# Altium schematic sheet 13- EtherCAT.SchDoc: ETHERCAT
size 420 x 297 mm; Revision: 1.0; SheetNumber: 13; SheetTotal: 13; Project: LOW LEVEL ECU
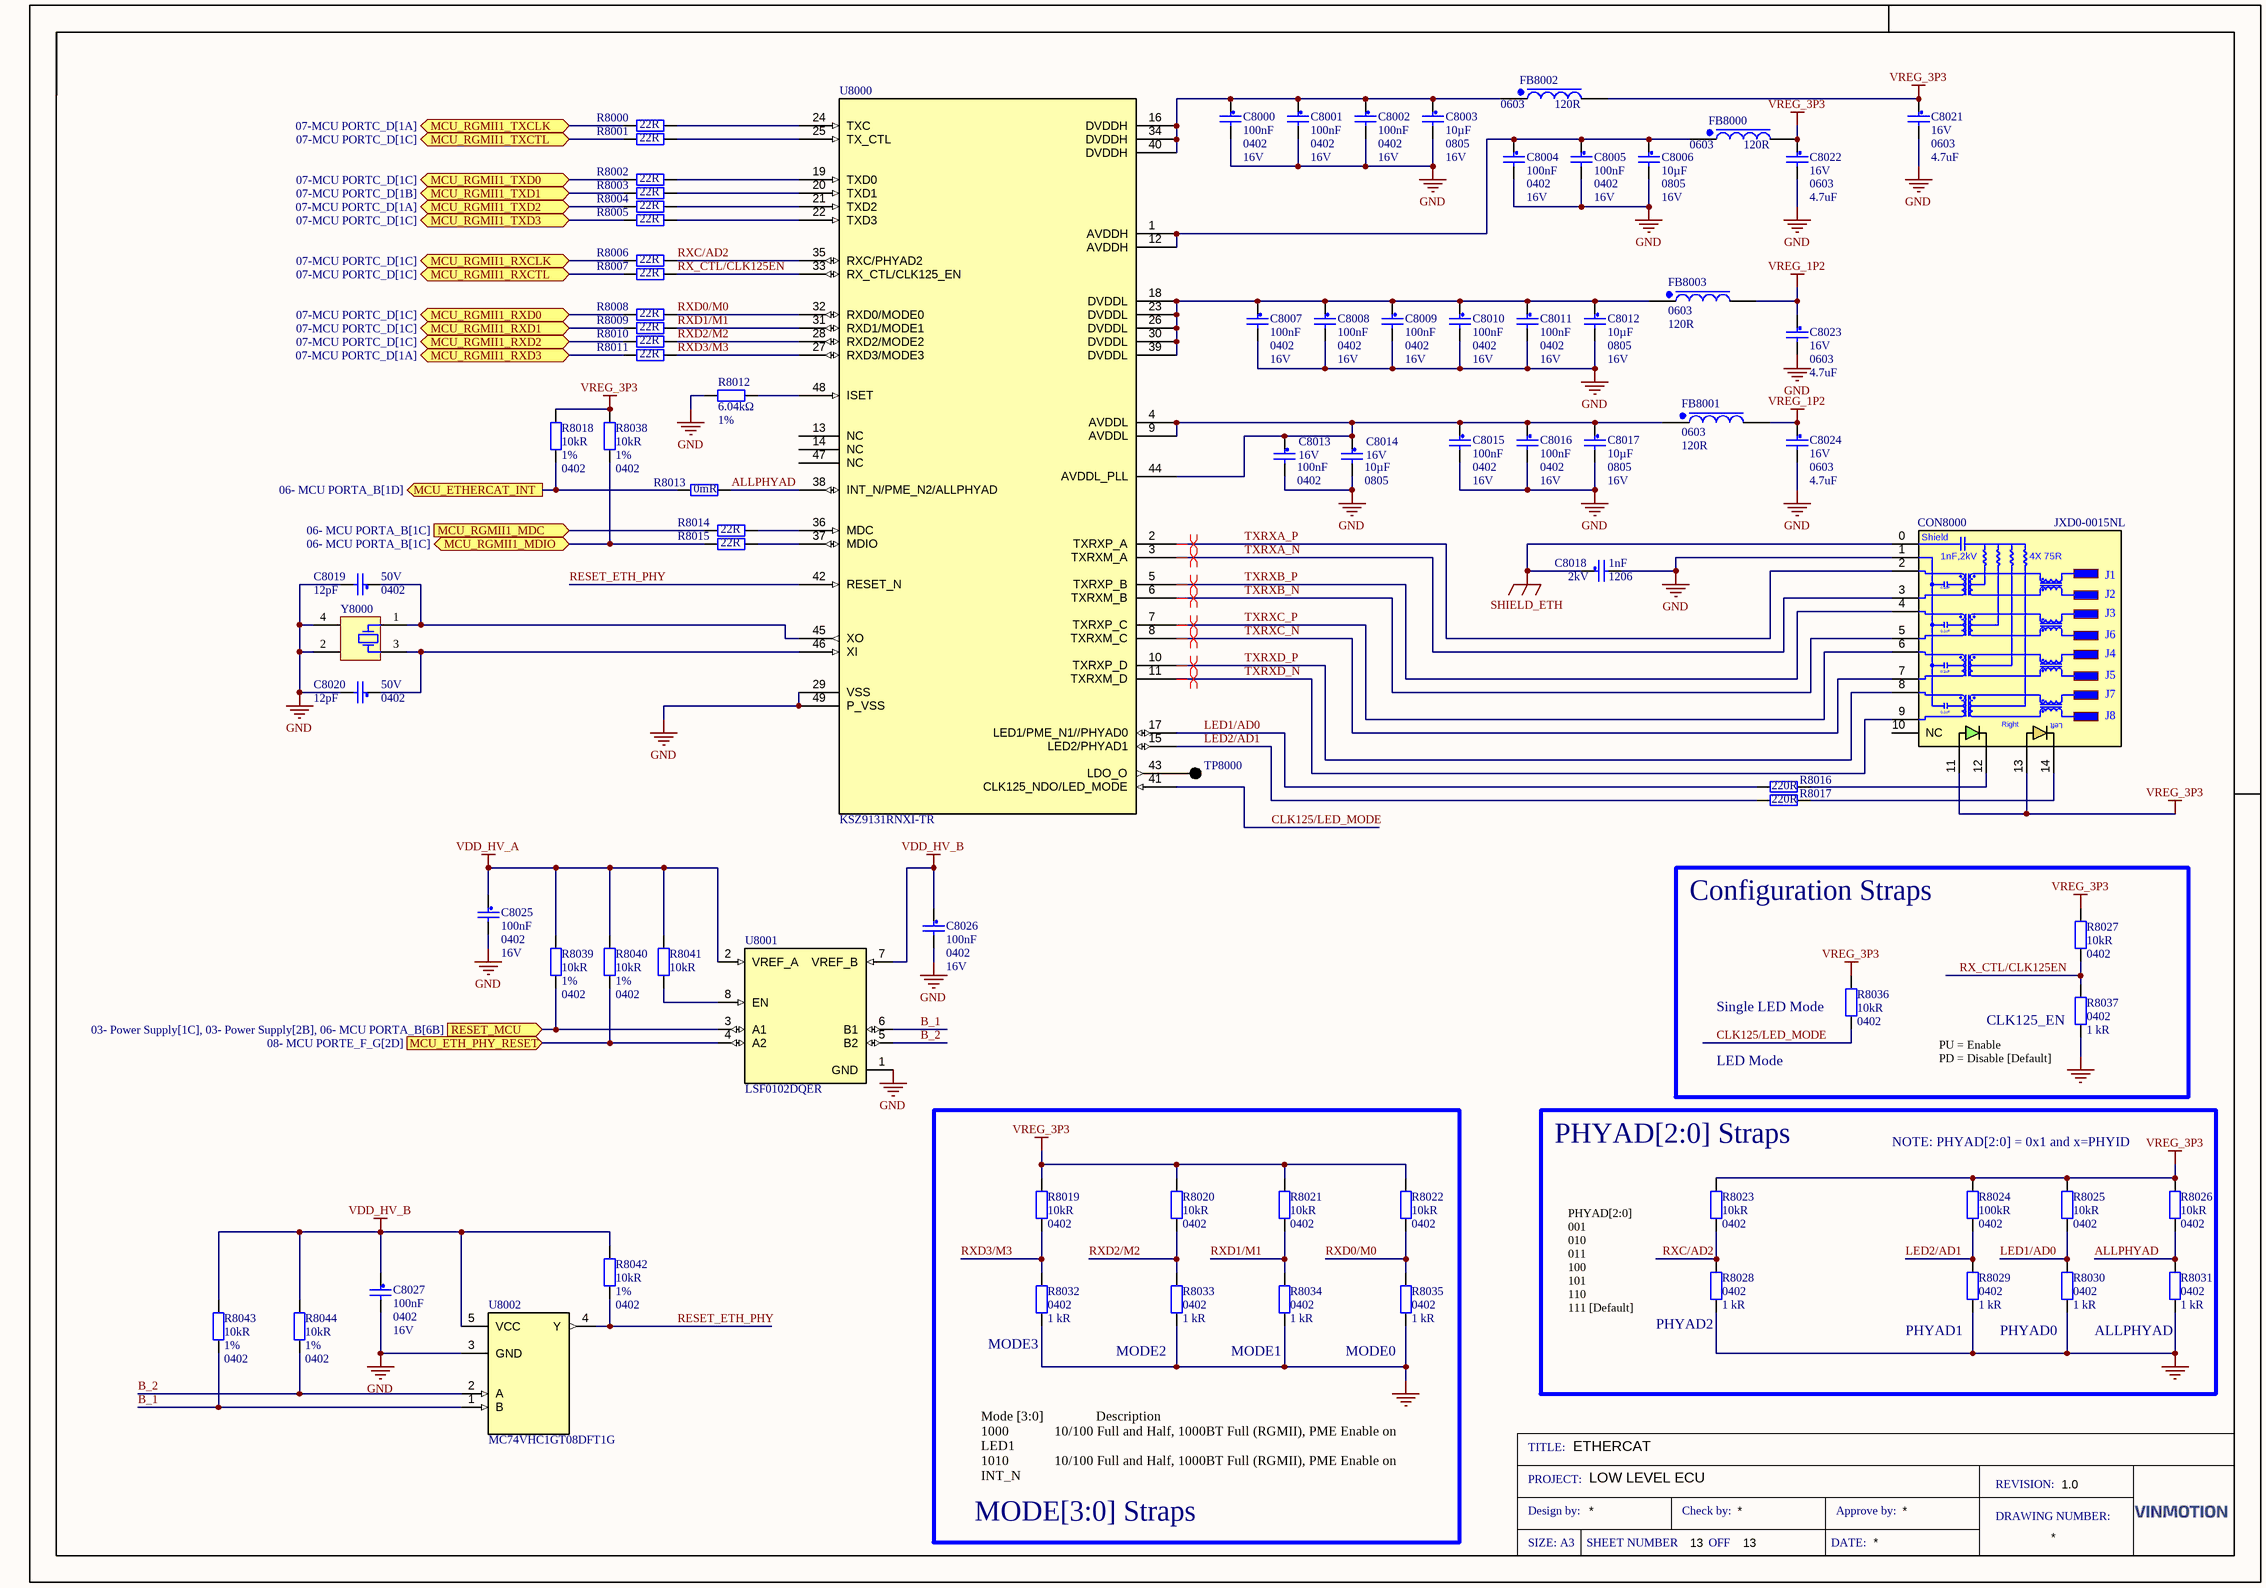
[diagram p0: 13- EtherCAT.SchDoc]

## Parts
C8000  Capacitance: 100nF  Case/Package: 0402  Voltage Rating (DC): 16V  [CAP0402]  (hidden comment: 0402YC104KAT2A)
C8001  Capacitance: 100nF  Case/Package: 0402  Voltage Rating (DC): 16V  [CAP0402]  (hidden comment: 0402YC104KAT2A)
C8002  Capacitance: 100nF  Case/Package: 0402  Voltage Rating (DC): 16V  [CAP0402]  (hidden comment: 0402YC104KAT2A)
C8003  value 10µF  Case/Package: 0805  Voltage Rating: 16V  [CAP0805]  (hidden comment: GRM21BZ71C106KE15L)
C8004  Capacitance: 100nF  Case/Package: 0402  Voltage Rating (DC): 16V  [CAP0402]  (hidden comment: 0402YC104KAT2A)
C8005  Capacitance: 100nF  Case/Package: 0402  Voltage Rating (DC): 16V  [CAP0402]  (hidden comment: 0402YC104KAT2A)
C8006  value 10µF  Case/Package: 0805  Voltage Rating: 16V  [CAP0805]  (hidden comment: GRM21BZ71C106KE15L)
C8007  Capacitance: 100nF  Case/Package: 0402  Voltage Rating (DC): 16V  [CAP0402]  (hidden comment: 0402YC104KAT2A)
C8008  Capacitance: 100nF  Case/Package: 0402  Voltage Rating (DC): 16V  [CAP0402]  (hidden comment: 0402YC104KAT2A)
C8009  Capacitance: 100nF  Case/Package: 0402  Voltage Rating (DC): 16V  [CAP0402]  (hidden comment: 0402YC104KAT2A)
C8010  Capacitance: 100nF  Case/Package: 0402  Voltage Rating (DC): 16V  [CAP0402]  (hidden comment: 0402YC104KAT2A)
C8011  Capacitance: 100nF  Case/Package: 0402  Voltage Rating (DC): 16V  [CAP0402]  (hidden comment: 0402YC104KAT2A)
C8012  value 10µF  Case/Package: 0805  Voltage Rating: 16V  [CAP0805]  (hidden comment: GRM21BZ71C106KE15L)
C8013  Capacitance: 100nF  Case/Package: 0402  Voltage Rating (DC): 16V  [CAP0402]  (hidden comment: 0402YC104KAT2A)
C8014  value 10µF  Case/Package: 0805  Voltage Rating: 16V  [CAP0805]  (hidden comment: GRM21BZ71C106KE15L)
C8015  Capacitance: 100nF  Case/Package: 0402  Voltage Rating (DC): 16V  [CAP0402]  (hidden comment: 0402YC104KAT2A)
C8016  Capacitance: 100nF  Case/Package: 0402  Voltage Rating (DC): 16V  [CAP0402]  (hidden comment: 0402YC104KAT2A)
C8017  value 10µF  Case/Package: 0805  Voltage Rating: 16V  [CAP0805]  (hidden comment: GRM21BZ71C106KE15L)
C8018  Voltage Rating: 2kV  Case/Package: 1206  Capacitance: 1nF  [CAP1206]  (hidden comment: C1206C102KGRACAUTO)
C8019  Voltage Rating: 50V  Case/Package: 0402  Capacitance: 12pF  [CAP0402]  (hidden comment: GCM1555C1H120JA16D)
C8020  Voltage Rating: 50V  Case/Package: 0402  Capacitance: 12pF  [CAP0402]  (hidden comment: GCM1555C1H120JA16D)
C8021  Voltage Rating: 16V  Case/Package: 0603  Capacitance: 4.7uF  [CAP0603]  (hidden comment: GRT188C81C475KE13D)
C8022  Voltage Rating: 16V  Case/Package: 0603  Capacitance: 4.7uF  [CAP0603]  (hidden comment: GRT188C81C475KE13D)
C8023  Voltage Rating: 16V  Case/Package: 0603  Capacitance: 4.7uF  [CAP0603]  (hidden comment: GRT188C81C475KE13D)
C8024  Voltage Rating: 16V  Case/Package: 0603  Capacitance: 4.7uF  [CAP0603]  (hidden comment: GRT188C81C475KE13D)
C8025  Capacitance: 100nF  Case/Package: 0402  Voltage Rating (DC): 16V  [CAP0402]  (hidden comment: 0402YC104KAT2A)
C8026  Capacitance: 100nF  Case/Package: 0402  Voltage Rating (DC): 16V  [CAP0402]  (hidden comment: 0402YC104KAT2A)
C8027  Capacitance: 100nF  Case/Package: 0402  Voltage Rating (DC): 16V  [CAP0402]  (hidden comment: 0402YC104KAT2A)
CON8000  JXD0-0015NL  [RJ45]
FB8000  Case/Package: 0603  Impedance: 120R  [FB0603]  (hidden comment: BLM18KG121TH1D)
FB8001  Case/Package: 0603  Impedance: 120R  [FB0603]  (hidden comment: BLM18KG121TH1D)
FB8002  Case/Package: 0603  Impedance: 120R  [FB0603]  (hidden comment: BLM18KG121TH1D)
FB8003  Case/Package: 0603  Impedance: 120R  [FB0603]  (hidden comment: BLM18KG121TH1D)
R8000  Resistance: 22R  [RES0402]  (hidden comment: CRCW040222R0JNED)
R8001  Resistance: 22R  [RES0402]  (hidden comment: CRCW040222R0JNED)
R8002  Resistance: 22R  [RES0402]  (hidden comment: CRCW040222R0JNED)
R8003  Resistance: 22R  [RES0402]  (hidden comment: CRCW040222R0JNED)
R8004  Resistance: 22R  [RES0402]  (hidden comment: CRCW040222R0JNED)
R8005  Resistance: 22R  [RES0402]  (hidden comment: CRCW040222R0JNED)
R8006  Resistance: 22R  [RES0402]  (hidden comment: CRCW040222R0JNED)
R8007  Resistance: 22R  [RES0402]  (hidden comment: CRCW040222R0JNED)
R8008  Resistance: 22R  [RES0402]  (hidden comment: CRCW040222R0JNED)
R8009  Resistance: 22R  [RES0402]  (hidden comment: CRCW040222R0JNED)
R8010  Resistance: 22R  [RES0402]  (hidden comment: CRCW040222R0JNED)
R8011  Resistance: 22R  [RES0402]  (hidden comment: CRCW040222R0JNED)
R8012  value 6.04kΩ  Tolerance: 1%  [RES0402]  (hidden comment: CRCW04026K04FKEDC)
R8013  Resistance: 0mR  [RES0402]  (hidden comment: RMCF0402ZT0R00)
R8014  Resistance: 22R  [RES0402]  (hidden comment: CRCW040222R0JNED)
R8015  Resistance: 22R  [RES0402]  (hidden comment: CRCW040222R0JNED)
R8016  value 220R  [RES0402]  (hidden comment: CRCW0402220RFKED)
R8017  value 220R  [RES0402]  (hidden comment: CRCW0402220RFKED)
R8018  value 10kR  Tolerance: 1%  Case/Package: 0402  [RES0402]  (hidden comment: RMCF0402FT10K0)
R8019  Resistance: 10kR  Case/Package: 0402  [RES0402]  (hidden comment: ERJ2GEJ103X)
R8020  Resistance: 10kR  Case/Package: 0402  [RES0402]  (hidden comment: ERJ2GEJ103X)
R8021  Resistance: 10kR  Case/Package: 0402  [RES0402]  (hidden comment: ERJ2GEJ103X)
R8022  Resistance: 10kR  Case/Package: 0402  [RES0402]  (hidden comment: ERJ2GEJ103X)
R8023  Resistance: 10kR  Case/Package: 0402  [RES0402]  (hidden comment: ERJ2GEJ103X)
R8024  Resistance: 100kR  Case/Package: 0402  [RES0402]  (hidden comment: RMCF0402FT100K)
R8025  Resistance: 10kR  Case/Package: 0402  [RES0402]  (hidden comment: ERJ2GEJ103X)
R8026  Resistance: 10kR  Case/Package: 0402  [RES0402]  (hidden comment: ERJ2GEJ103X)
R8027  Resistance: 10kR  Case/Package: 0402  [RES0402]  (hidden comment: ERJ2GEJ103X)
R8028  Case/Package: 0402  Resistance: 1 kR  [RES0402]  (hidden comment: RK73H1ETTP1001F)
R8029  Case/Package: 0402  Resistance: 1 kR  [RES0402]  (hidden comment: RK73H1ETTP1001F)
R8030  Case/Package: 0402  Resistance: 1 kR  [RES0402]  (hidden comment: RK73H1ETTP1001F)
R8031  Case/Package: 0402  Resistance: 1 kR  [RES0402]  (hidden comment: RK73H1ETTP1001F)
R8032  Case/Package: 0402  Resistance: 1 kR  [RES0402]  (hidden comment: RK73H1ETTP1001F)
R8033  Case/Package: 0402  Resistance: 1 kR  [RES0402]  (hidden comment: RK73H1ETTP1001F)
R8034  Case/Package: 0402  Resistance: 1 kR  [RES0402]  (hidden comment: RK73H1ETTP1001F)
R8035  Case/Package: 0402  Resistance: 1 kR  [RES0402]  (hidden comment: RK73H1ETTP1001F)
R8036  Resistance: 10kR  Case/Package: 0402  [RES0402]  (hidden comment: ERJ2GEJ103X)
R8037  Case/Package: 0402  Resistance: 1 kR  [RES0402]  (hidden comment: RK73H1ETTP1001F)
R8038  value 10kR  Tolerance: 1%  Case/Package: 0402  [RES0402]  (hidden comment: RMCF0402FT10K0)
R8039  value 10kR  Tolerance: 1%  Case/Package: 0402  [RES0402]  (hidden comment: RMCF0402FT10K0)
R8040  value 10kR  Tolerance: 1%  Case/Package: 0402  [RES0402]  (hidden comment: RMCF0402FT10K0)
R8041  value 10kR  [RES0402]  (hidden comment: RMCF0402FT10K0)
R8042  value 10kR  Tolerance: 1%  Case/Package: 0402  [RES0402]  (hidden comment: RMCF0402FT10K0)
R8043  value 10kR  Tolerance: 1%  Case/Package: 0402  [RES0402]  (hidden comment: RMCF0402FT10K0)
R8044  value 10kR  Tolerance: 1%  Case/Package: 0402  [RES0402]  (hidden comment: RMCF0402FT10K0)
TP8000  TP  [TP-SMD-R1]  (value not drawn)  (no BOM)
U8000  KSZ9131RNXI-TR  [QFN50P700X700X90_HS-49N]
U8001  LSF0102DQER  [8-XFDFN]
U8002  MC74VHC1GT08DFT1G  [SOT95P280X145-5N]
Y8000  NX3225SA-25.000M-STD-CRS-2  [NDK_NX3225SA-25.000M-STD-CRS-2_R]  (value not drawn)

## Blocks framed on the sheet
Configuration Straps: R8027 R8036 R8037
MODE[3:0] Straps: R8019-R8022 R8032-R8035
PHYAD[2:0] Straps: R8023-R8026 R8028-R8031

## Ports
MCU_ETH_PHY_RESET (in, see 08- MCU PORTE_F_G[2D]), MCU_ETHERCAT_INT (out, see 06- MCU PORTA_B[1D]), MCU_RGMII1_MDC (in, see 06- MCU PORTA_B[1C]), MCU_RGMII1_MDIO (bidir, see 06- MCU PORTA_B[1C]), MCU_RGMII1_RXCLK (bidir, see 07-MCU PORTC_D[1C]), MCU_RGMII1_RXCTL (bidir, see 07-MCU PORTC_D[1C]), MCU_RGMII1_RXD0 (bidir, see 07-MCU PORTC_D[1C]), MCU_RGMII1_RXD1 (bidir, see 07-MCU PORTC_D[1C]), MCU_RGMII1_RXD2 (bidir, see 07-MCU PORTC_D[1C]), MCU_RGMII1_RXD3 (bidir, see 07-MCU PORTC_D[1A]), MCU_RGMII1_TXCLK (bidir, see 07-MCU PORTC_D[1A]), MCU_RGMII1_TXCTL (bidir, see 07-MCU PORTC_D[1C]), MCU_RGMII1_TXD0 (bidir, see 07-MCU PORTC_D[1C]), MCU_RGMII1_TXD1 (bidir, see 07-MCU PORTC_D[1B]), MCU_RGMII1_TXD2 (bidir, see 07-MCU PORTC_D[1A]), MCU_RGMII1_TXD3 (bidir, see 07-MCU PORTC_D[1C]), RESET_MCU (in, see 03- Power Supply[1C], 03- Power Supply[2B], 06- MCU PORTA_B[6B])

## Nets
GND: C8000.2 C8001.2 C8002.2 C8003.2 C8004.2 C8005.2 C8006.2 C8007.2 C8008.2 C8009.2 C8010.2 C8011.2 C8012.2 C8013.2 C8014.2 C8015.2 C8016.2 C8017.2 C8018.2 C8019.2 C8020.2 C8021.2 C8022.2 C8023.2 C8024.2 C8025.2 C8026.2 C8027.2 CON8000.1 R8012.1 R8028.1 R8029.1 R8030.1 R8031.1 R8032.1 R8033.1 R8034.1 R8035.1 R8037.1 U8000.29(VSS) U8000.49(P_VSS) U8001.1(GND) U8002.3(GND) Y8000.2(GND) Y8000.4(GND)
SHIELD_ETH: C8018.1 CON8000.0
VDD_HV_A: C8025.1 R8039.2 R8040.2 R8041.2 U8001.2(VREF_A)
VDD_HV_B: C8026.1 C8027.1 R8042.2 R8043.2 R8044.2 U8001.7(VREF_B) U8002.5(VCC)
VREG_1P2: C8023.1 C8024.1 FB8001.2 FB8003.2
VREG_3P3: C8021.1 C8022.1 CON8000.11 CON8000.13 FB8000.2 FB8002.2 R8018.2 R8019.2 R8020.2 R8021.2 R8022.2 R8023.2 R8024.2 R8025.2 R8026.2 R8027.2 R8036.2 R8038.2
ALLPHYAD: R8013.2 R8026.1 R8031.2 U8000.38(INT_N/PME_N2/ALLPHYAD)
B_1: R8043.1 U8001.6(B1) U8002.1(B)
B_2: R8044.1 U8001.5(B2) U8002.2(A)
CLK125/LED_MODE: R8036.1 U8000.41(CLK125_NDO/LED_MODE)
LED1/AD0: R8016.2 R8025.1 R8030.2 U8000.17(LED1/PME_N1//PHYAD0)
LED2/AD1: R8017.2 R8024.1 R8029.2 U8000.15(LED2/PHYAD1)
MCU_ETH_PHY_RESET: R8040.1 U8001.4(A2) ; port MCU_ETH_PHY_RESET
MCU_ETHERCAT_INT: R8013.1 R8018.1 ; port MCU_ETHERCAT_INT
MCU_RGMII1_MDC: R8014.1 ; port MCU_RGMII1_MDC
MCU_RGMII1_MDIO: R8015.1 R8038.1 ; port MCU_RGMII1_MDIO
MCU_RGMII1_RXCLK: R8006.1 ; port MCU_RGMII1_RXCLK
MCU_RGMII1_RXCTL: R8007.1 ; port MCU_RGMII1_RXCTL
MCU_RGMII1_RXD0: R8008.1 ; port MCU_RGMII1_RXD0
MCU_RGMII1_RXD1: R8009.1 ; port MCU_RGMII1_RXD1
MCU_RGMII1_RXD2: R8010.1 ; port MCU_RGMII1_RXD2
MCU_RGMII1_RXD3: R8011.1 ; port MCU_RGMII1_RXD3
MCU_RGMII1_TXCLK: R8000.1 ; port MCU_RGMII1_TXCLK
MCU_RGMII1_TXCTL: R8001.1 ; port MCU_RGMII1_TXCTL
MCU_RGMII1_TXD0: R8002.1 ; port MCU_RGMII1_TXD0
MCU_RGMII1_TXD1: R8003.1 ; port MCU_RGMII1_TXD1
MCU_RGMII1_TXD2: R8004.1 ; port MCU_RGMII1_TXD2
MCU_RGMII1_TXD3: R8005.1 ; port MCU_RGMII1_TXD3
RESET_ETH_PHY: R8042.1 U8000.42(RESET_N) U8002.4(Y)
RESET_MCU: R8039.1 U8001.3(A1) ; port RESET_MCU
RX_CTL/CLK125EN: R8007.2 R8027.1 R8037.2 U8000.33(RX_CTL/CLK125_EN)
RXC/AD2: R8006.2 R8023.1 R8028.2 U8000.35(RXC/PHYAD2)
RXD0/M0: R8008.2 R8022.1 R8035.2 U8000.32(RXD0/MODE0)
RXD1/M1: R8009.2 R8021.1 R8034.2 U8000.31(RXD1/MODE1)
RXD2/M2: R8010.2 R8020.1 R8033.2 U8000.28(RXD2/MODE2)
RXD3/M3: R8011.2 R8019.1 R8032.2 U8000.27(RXD3/MODE3)
TXRXA_N: CON8000.3 U8000.3(TXRXM_A)
TXRXA_P: CON8000.2 U8000.2(TXRXP_A)
TXRXB_N: CON8000.5 U8000.6(TXRXM_B)
TXRXB_P: CON8000.4 U8000.5(TXRXP_B)
TXRXC_N: CON8000.7 U8000.8(TXRXM_C)
TXRXC_P: CON8000.6 U8000.7(TXRXP_C)
TXRXD_N: CON8000.9 U8000.11(TXRXM_D)
TXRXD_P: CON8000.8 U8000.10(TXRXP_D)
NetC8000_1: C8000.1 C8001.1 C8002.1 C8003.1 FB8002.1 U8000.16(DVDDH) U8000.34(DVDDH) U8000.40(DVDDH)
NetC8004_1: C8004.1 C8005.1 C8006.1 FB8000.1 U8000.1(AVDDH) U8000.12(AVDDH)
NetC8007_1: C8007.1 C8008.1 C8009.1 C8010.1 C8011.1 C8012.1 FB8003.1 U8000.18(DVDDL) U8000.23(DVDDL) U8000.26(DVDDL) U8000.30(DVDDL) U8000.39(DVDDL)
NetC8013_1: C8013.1 C8014.1 C8015.1 C8016.1 C8017.1 FB8001.1 U8000.4(AVDDL) U8000.9(AVDDL) U8000.44(AVDDL_PLL)
NetC8019_1: C8019.1 U8000.45(XO) Y8000.1(OSC1)
NetC8020_1: C8020.1 U8000.46(XI) Y8000.3(OSC2)
NetCON8000_12: CON8000.12 R8016.1
NetCON8000_14: CON8000.14 R8017.1
NetR8000_2: R8000.2 U8000.24(TXC)
NetR8001_2: R8001.2 U8000.25(TX_CTL)
NetR8002_2: R8002.2 U8000.19(TXD0)
NetR8003_2: R8003.2 U8000.20(TXD1)
NetR8004_2: R8004.2 U8000.21(TXD2)
NetR8005_2: R8005.2 U8000.22(TXD3)
NetR8012_2: R8012.2 U8000.48(ISET)
NetR8014_2: R8014.2 U8000.36(MDC)
NetR8015_2: R8015.2 U8000.37(MDIO)
NetR8041_1: R8041.1 U8001.8(EN)
NetTP8000_1: TP8000.1 U8000.43(LDO_O)

Not connected (* = marked no-connect by the designer): CON8000 10(NC); U8000 13(NC) 14(NC) 47(NC)

## Layout directives
differential pair; net class 100ohm Differential: TXRXA_N, TXRXA_P, TXRXB_N, TXRXB_P, TXRXC_N, TXRXC_P, TXRXD_N, TXRXD_P

## Notes on the sheet
- (near R8036) Single LED Mode
- LED Mode
- (near R8037) PU = Enable
  PD = Disable [Default]
- (near R8037) CLK125_EN
- NOTE: PHYAD[2:0] = 0x1 and x=PHYID
- PHYAD[2:0]                                             001
  010
  011
  100
  101
  110
  111 [Default]
- (near R8028) PHYAD2
- (near R8029) PHYAD1
- PHYAD0
- ALLPHYAD
- (near R8032) MODE3
- (near R8033) MODE2
- (near R8034) MODE1
- (near R8035) MODE0
- Mode [3:0]               Description
  1000             10/100 Full and Half, 1000BT Full (RGMII), PME Enable on LED1
  1010             10/100 Full and Half, 1000BT Full (RGMII), PME Enable on INT_N
  1100             1000BT Full (RGMII)
  1110             10/100 Full and Half, 1000BT Full (RGMII) [Default]
- TITLE:
- PROJECT:
- Design by:
- Check by:
- Approve by:
- DRAWING NUMBER:
- REVISION:
- SIZE: A3
- SHEET NUMBER
- OFF
- DATE:
- (in symbol CMP-01191-1) Shield; 1nF,2kV; 4X 75R; J1; 0.1uF; J2; J3; J6; J4; J5; J7; Left; J8; Right

## Library data of the parts
C8000-C8002 C8004 C8005 C8007-C8011 C8013 C8015 C8016 C8025-C8027 = CMP-00988-1: CAP CER 0.1UF 16V X7R 0402; Manufacturer 1: KYOCERA AVX; Crossable(YES/NO): YES; Mount Type(SMD/TH): SMD; Case Code (Imperial): 0402; Case Code (Metric): 1005; Dielectric: X7R; Manufacturer Part Number 1: 0402YC104KAT2A; Max Operating Temperature: 125°C; Min Operating Temperature: -55°C; Mount: Surface Mount; Voltage Rating: 16V
C8003 C8006 C8012 C8014 C8017 = CMP-01170-1: CAP CER 10UF 16V X7R 0805; Manufacturer: Murata; Manufacturer Lifecycle Status: IN PRODUCTION; Dielectric Material: Ceramic; Tolerance: 10%; Length: 2mm; Category: Ceramic Capacitors; Height: 1.25mm; Lifecycle Status: Production; Manufacturer Part Number: GRM21BZ71C106KE15L; Material: Ceramic; Max Operating Temperature: 125°C; Min Operating Temperature: -55°C; Mounting Technology: Surface Mount; Number of Terminals: 2; REACH SVHC: Yes; RoHS: Compliant; Thickness: 1.25mm; Voltage Rating (DC): 16V; Width: 1.25mm
C8018 = CMP-00118-3: CAP CER 1000PF 2KV X7R 1206; Manufacturer 1: KEMET; Dielectric Material: Ceramic; Mount Type(SMD/TH): SMD; Tolerance: 10%; Crossable(YES/NO): YES; REACH SVHC: No SVHC; Case Code (Imperial): 1206; Dielectric: X7R; Packaging: Tape and Reel; Length: 0.126inch; Max Operating Temperature: 125°C; Thickness: 0.069inch; Min Operating Temperature: -55°C; Voltage Rating (DC): 2kV; Mount: Surface Mount; Width: 0.063inch; Manufacturer Part Number 1: C1206C102KGRACAUTO; Termination: SMD/SMT; Ratings: AEC-Q200; Case Code (Metric): 3216; Contact Plating: Tin,Matte; Height: 1.6mm; Lead Free: Lead Free
C8019 C8020 = CMP-00203-1: CAP CER 12PF 50V C0G/NP0 0402; Manufacturer 1: Murata Electronics; Dielectric: C0G; Crossable(YES/NO): YES; Mount Type(SMD/TH): SMD; Tolerance: 5%; Mount: Surface Mount; Lead Free: Lead Free; Weight: 0.000212oz; Ratings: AEC-Q200; Termination: SMD/SMT; Packaging: Tape and Reel; Max Operating Temperature: 125°C; Case Code (Imperial): 0402; Height: 0.5mm; Voltage Rating (DC): 50V; Manufacturer Part Number 1: GCM1555C1H120JA16D; Thickness: 0.022inch; Width: 0.02inch; Case Code (Metric): 1005; Min Operating Temperature: -55°C; Length: 0.039inch; Package Quantity: 10000
C8021-C8024 = CMP-00351-2: CAP CER 4.7uF 16V 10% X6S 0603 SMD; Manufacturer 1: Murata Electronics; Crossable(YES/NO): YES; Case Code (Imperial): 0603; Tolerance: 10%; Packaging: Tape and Reel; Width: 0.031inch; Case Code (Metric): 1608; Mount Type(SMD/TH): SMD; Min Operating Temperature: -55°C; Max Operating Temperature: 105°C; Mount: Surface Mount; Thickness: 0.035inch; Manufacturer Part Number 1: GRT188C81C475KE13D; Ratings: AEC-Q200; Length: 0.063inch; Height: 0.8mm; Lead Free: Lead Free; Voltage Rating (DC): 16V
CON8000 = CMP-01191-1: 1 Port RJ45 Through Hole 10/100/1000 Base-T, AutoMDIX; Manufacturer: Pulse Electronics; Dielectric Material: Polyethylene; Number of Ports: 1; Plating Thickness: 762nm; Row Spacing: 2.54mm; Manufacturer Part Number: JXD0-0015NL; Category: Modular / Ethernet Connectors; Contact Gender: Female; Lifecycle Status: Production; Max Operating Temperature: 85°C; Min Operating Temperature: -40°C; Pins: 10; Number of Rows: 2; REACH SVHC: Yes; RoHS: Compliant; Shell Finish: Nickel; Shell Material: Brass; Terminal Pitch: 2.54mm
FB8000-FB8003 = CMP-ROOT-0013-6: FERRITE BEAD 120 OHM 0603 1LN; Manufacturer 1: Murata Electronics; Mount Type(SMD/TH): SMD; Max Current Rating: 3A; Number of Circuits: 1; Crossable(YES/NO): YES; DC Resistance (DCR): 30mR; Manufacturer Part Number 1: BLM18KG121TH1D; Height: 0.03inch; Package Quantity: 1; Max Operating Temperature: 125°C; Mount: Surface Mount; Ratings: AEC-Q200; Min Operating Temperature: -55°C; Number of Lines: 1; Length: 0.063inch; Packaging: Tape and Reel; Case Code (Metric): 1608; Width: 0.032inch; Case Code (Imperial): 0603
R8000-R8011 R8014 R8015 = CMP-00237-1: RES SMD 22 OHM 5% 1/16W 0402; Manufacturer 1: Vishay Dale; Power Rating: 63mW; Voltage Rating: 50V; Temperature Coefficient: 200ppm/°C; Crossable(YES/NO): NO; Contact Plating: Tin; Max Power Dissipation: 63mW; Height: 0.016inch; Width: 0.5mm; Packaging: Tape and Reel; Package Quantity: 1; Weight: 2.3E-05oz; Depth: 0.5mm; Tolerance: 5%; Case Code (Imperial): 0402; Features: Automotive AEC-Q200; Max Operating Temperature: 155°C; Min Operating Temperature: -55°C; Military Standard: Not; Termination: SMD/SMT; Manufacturer Part Number 1: CRCW040222R0JNED; Case Code (Metric): 1005; Length: 1mm; Composition: Thick Film; REACH SVHC: Unknown; Number of Pins: 2; Mount Type(SMD/TH): SMD; Number of Terminations: 2; Case/Package: 0402
R8012 = CMP-01177-1: RES 6.04K OHM 1% 1/16W 0402; Manufacturer: Vishay; Power Dissipation: 63mW; Temperature Coefficient: 100ppm/°C; Working Voltage: 50V; Lifecycle Status: Production; Case/Package: 0402; Category: Chip SMD Resistors; China RoHS: Non-Compliant; Height: 300µm; Lead Free: Lead Free; Manufacturer Part Number: CRCW04026K04FKEDC; Max Operating Temperature: 155°C; Min Operating Temperature: -55°C; Mounting Technology: Surface Mount; Number of Terminals: 2; REACH SVHC: Yes; RoHS: Compliant; Schedule B: 8533210045, 8533210045|8533210045|8533210045|8533210045|8533210045; Width: 500µm
R8013 = CMP-ROOT-0037-10: RES 0R 1/16W 1% 0402 SMD; Manufacturer 1: Stackpole Electronics Inc; Max Power Dissipation: 63mW; Crossable(YES/NO): YES; Current Rating: 1A; Working Voltage: 50V; Height: 0.016inch; Radiation Hardening: No; Max Operating Temperature: 155°C; Min Operating Temperature: -55°C; Lead Free: Lead Free; Contact Plating: Tin,Matte; Number of Terminations: 2; Features: Automotive AEC-Q200; Case Code (Metric): 1005; Mount: Surface Mount; Packaging: Tape and Reel; Width: 0.02inch; Mount Type(SMD/TH): SMD; Length: 0.039inch; Depth: 0.5mm; Composition: Thick Film; Power Rating: 63mW; Military Standard: Not; Case Code (Imperial): 0402; Manufacturer Part Number 1: RMCF0402ZT0R00; Case/Package: 0402
R8016 R8017 = CMP-01126-1: RES SMD 220 OHM 1% 1/10W 0402; Manufacturer: Vishay; Package Height: 0.35mm; Package Length: 1mm; Package Width: 0.5mm; Power: 63mW; Rated Temperature: 70°C; Reference Standard: AEC-Q200; Temperature Coefficient (ppm/Cel): 100; Working Voltage: 50V; Category: Chip SMD Resistors; Construction: Chip; JESD-609 Code: e3; Manufacturer Part Number: CRCW0402220RFKED; Max Operating Temperature: 155°C; Min Operating Temperature: -55°C; Mounting Technology: Surface Mount; Pins: 2; Package Shape: Rectangular; Packaging: Tape and Reel; Reach SVHC Compliant: Yes; Resistor Type: FIXED RESISTOR; RoHS Compliant: Yes; Case/Package: 0402; Technology: METAL GLAZE/THICK FILM; Terminal Finish: Nickel; Termination: Wraparound; Tolerance: 1%
R8018 R8038-R8044 = CMP-01105-1: RES 10K OHM 1% 1/16W 0402; Manufacturer: Stackpole Electronics; Package Length: 1mm; Package Height: 0.3mm; Package Width: 0.5mm; Power: 63mW; Rated Temperature: 70°C; Reference Standard: AEC-Q200; Temperature Coefficient (ppm/Cel): 100; Working Voltage: 50V; Category: Chip SMD Resistors; Construction: Rectangular; JESD-609 Code: e3; Manufacturer Part Number: RMCF0402FT10K0; Max Operating Temperature: 155°C; Min Operating Temperature: -55°C; Mounting Technology: Surface Mount; Pins: 2; Package Shape: Rectangular; Packaging: Tape and Reel; Reach SVHC Compliant: Yes; Resistor Type: FIXED RESISTOR; RoHS Compliant: Yes; Technology: METAL GLAZE/THICK FILM; Terminal Finish: Nickel; Termination: Wraparound
  R8041: Tolerance: 1%; Case/Package: 0402
R8019-R8023 R8025-R8027 R8036 = CMP-00039-6: RES SMD 10K OHM 5% 1/10W 0402; Manufacturer 1: Panasonic Electronic Components; Temperature Coefficient: 200ppm/°C; Max Power Dissipation: 100mW; Crossable(YES/NO): YES; Voltage Rating: 50V; Width: 0.02inch; Tolerance: 5%; Number of Terminations: 2; Max Operating Temperature: 155°C; Case Code (Imperial): 0402; Military Standard: Not; Lead Free: Lead Free; Length: 1mm; Manufacturer Part Number 1: ERJ2GEJ103X; Composition: Thick Film; Mount: Surface Mount; REACH SVHC: No SVHC; Mount Type(SMD/TH): SMD; Power Rating: 100mW; Radiation Hardening: No; Package Quantity: 1; Features: Automotive AEC-Q200; Case Code (Metric): 1005; Voltage Rating (DC): 50V; Termination: SMD/SMT; Contact Plating: Tin; Height: 0.35mm; Depth: 0.5mm; Min Operating Temperature: -55°C; Packaging: Cut Tape
R8024 = CMP-00623-2: RES 100kR 1/16W 1% 0402 SMD; Manufacturer 1: Stackpole Electronics Inc; Max Power Dissipation: 63mW; Crossable(YES/NO): YES; Power Rating: 62.5mW; Temperature Coefficient: 100ppm/°C; Length: 1mm; Case Code (Metric): 1005; Military Standard: Not; Case Code (Imperial): 0402; Height: 0.016inch; Number of Terminations: 2; Min Operating Temperature: -55°C; Contact Plating: Tin,Matte; Width: 0.02inch; Depth: 0.5mm; Max Operating Temperature: 155°C; Mount: Surface Mount; Mount Type(SMD/TH): SMD; Composition: Thick Film; Packaging: Tape and Reel; Features: Automotive AEC-Q200; Lead Free: Lead Free; Tolerance: 1%; Manufacturer Part Number 1: RMCF0402FT100K; Radiation Hardening: No
R8028-R8035 R8037 = CMP-00903-1: RES 1K OHM 1% 1/10W 0402; Manufacturer 1: KOA Speer Electronics, Inc.; Crossable(YES/NO): YES; Mount Type(SMD/TH): SMD; Voltage Rating: 50V; Temperature Coefficient: 100ppm/°C; Manufacturer Part Number 1: RK73H1ETTP1001F; Min Operating Temperature: -55°C; Max Operating Temperature: 155°C; Power Rating: 1/10W; Supplier 1: Digi-Key; Stock 1: 1723025; Pricing 1: 1=0.10000, 10=0.02400, 100=0.00970, 1000=0.00437, 2500=0.00380, 5000=0.00314 (USD); RoHS: Yes; Mount: Surface Mount; Case Code (Imperial): 0402; Case Code (Metric): 1005; Tolerance: 1%; Packaging: Tape and Reel; Package Quantity: 10000; Composition: Thick Film; Termination: SMD/SMT; Military Standard: Not; Voltage Rating (DC): 50V; Length: 1mm; Height: 0.35mm; Width: 0.5mm; Depth: 0.5mm; Lead Free: Lead Free; ComponentLink1URL: https://datasheet.ciiva.com/5554/rk73h-5554172.pdf?src-supplier=Mouser; ComponentLink1Description: https://datasheet.ciiva.com/5554/rk73h-5554172.pdf?src-supplier=Mouser; Supplier Part Number 1: 2019-RK73H1ETTP1001FCT-ND
TP8000 = CMP-ROOT-0080-12: Test Point 1x1mm; Manufacturer Part Number 1: NA; Mount Type(SMD/TH): TH; Crossable(YES/NO): YES; Manufacturer 1: N/A
U8000 = CMP-01190-1: IC TXRX FULL/HALF 4/4 48QFN; Manufacturer: Microchip; Interface: Ethernet; Max Junction Temperature (Tj): 125°C; Max Supply Voltage: 3.63V; Min Supply Voltage: 1.14V; Number of Channels: 4; Export Control Classification Number (ECCN) Code: 5A991.b.1; Ambient Temperature Range High: 85°C; Case/Package: VQFN; Category: Ethernet Interface ICs; Country of Assembly: China, Taiwan; Country of Fabrication: Taiwan; Country of Origin: China, Taiwan; Harmonized Tariff Schedule (HTS) Code: 8542.39.0060; Height: 900µm; Introduction Date: 2019-10-15; Lifecycle Status: Production; Manufacturer Part Number: KSZ9131RNXI-TR; Max Operating Temperature: 85°C; Min Operating Temperature: -40°C; Pins: 48; Projected EOL Date: 2044-10-15; RoHS: Compliant; Schedule B: 8542390000|8542390000|8542390000|8542390000|8542390000|8542390000|8542390000|8542390000|8542390000|8542390000|8542390000|8542390000|8542390000|8542390000|8542390000|8542390000|8542390000|8542390000|8542390000|8542390000|8542390000|8542390000|8542390000|85
U8001 = CMP-01193-1: IC VOLTAGE LEVEL BIDIR 8-X2SON; Manufacturer: Texas Instruments; Manufacturer Lifecycle Status: ACTIVE; Channel Type: Bidirectional; Data Rate: 200Mbps; High Level Output Current: 64mA; Logic Function: Translator; Max Junction Temperature (Tj): 150°C; Max Supply Voltage: 5.5V; Min Supply Voltage: 950mV; Number of Bits: 1; Propagation Delay: 1.3ns; Turn-On Delay Time: 1.5ns; Min Operating Temperature: -40°C; Ambient Temperature Range High: 125°C; Category: Voltage Level Shifters; Height: 400µm; Lead Free: Lead Free; Length: 1.4mm; Lifecycle Status: Production; Low Level Output Current: 64mA; Manufacturer Part Number: LSF0102DQER; Max Operating Temperature: 125°C; Mounting Technology: Surface Mount; Number of Circuits: 1; Number of Inputs: 1; Number of Outputs: 1; Pins: 8; Packaging: Digi-Reel®; Radiation Hardening: No; RoHS: Compliant; Schedule B: 8542390000, 8542390000|8542390000|8542390000|8542390000|8542390000; Thickness: 370µm; Width: 1mm
U8002 = CMP-01194-1: IC GATE AND 1CH 2-INP SC88A; Manufacturer: onsemi; Manufacturer Lifecycle Status: ACTIVE; Number of Outputs: 1; Max Supply Voltage: 5.5V; Min Supply Voltage: 3V; Number of Inputs: 2; Operating Supply Voltage: 3.3V; Propagation Delay: 16.5ns; Category: Logic Gates; China RoHS: Compliant; Height - Seated (Max): 1.1mm; Length: 2mm; Lifecycle Status: Production; Manufacturer Part Number: MC74VHC1GT08DFT1G; Max Operating Temperature: 125°C; Min Operating Temperature: -55°C; Number of Channels: 1; Number of Circuits: 1; Number of Terminals: 5; REACH SVHC: Yes; RoHS: Compliant; Terminal Pitch: 650µm; Width: 1.25mm
Y8000 = CMP-00003-5: CRYSTAL 25.0000MHZ 8PF SMD; Manufacturer 1: NDK America, Inc.; ESR (Equivalent Series Resistance): 100R; Crossable(YES/NO): NO; Frequency: 25MHz; Frequency Stability: 50ppm; Frequency Tolerance: 15ppm; Height: 0.024inch; Width: 0.098inch; Length: 0.126inch; Packaging: Tape and Reel; Mount: Surface Mount; Max Operating Temperature: 125°C; Min Operating Temperature: -40°C; Manufacturer Part Number 1: NX3225SA-25.000M-STD-CRS-2; Mount Type(SMD/TH): SMD; Case/Package: SMD/SMT; Load Capacitance: 8pF; Ratings: AEC-Q200